# EAGLE design SB_TS_2.08_Final (EAGLE 8.5.0)
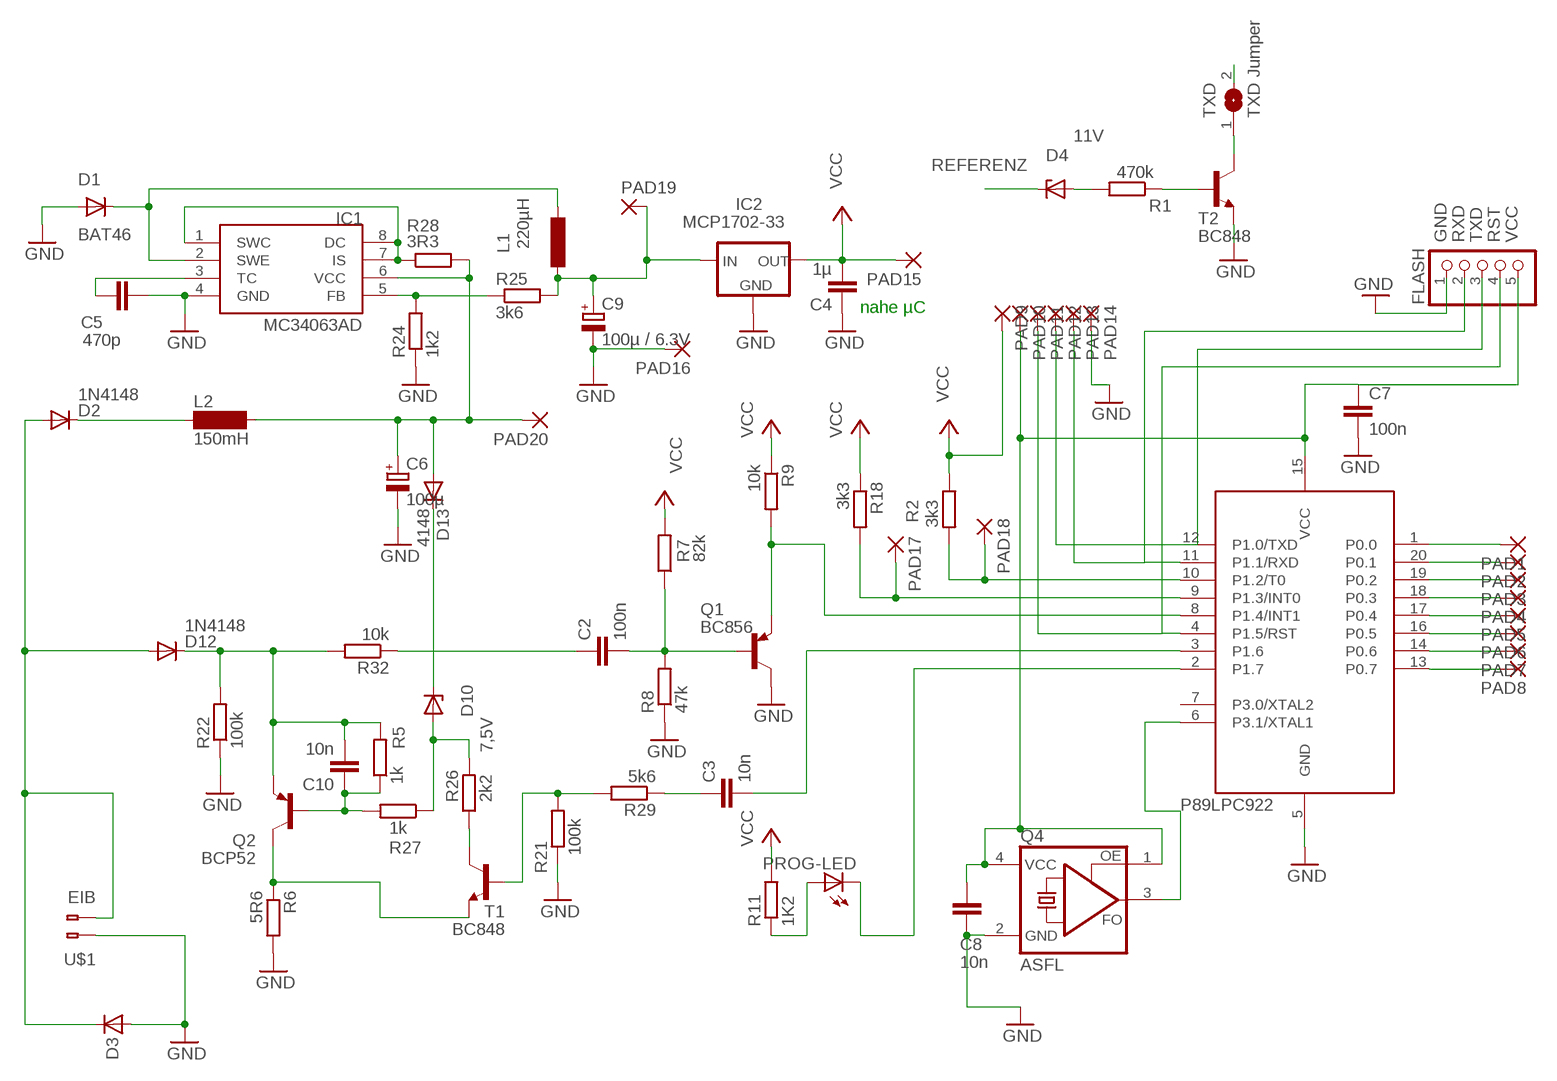
[diagram p0: schematic, sheet 1]

## Parts
C2  100n  C-EUC1206  [C1206]
C3  10n  C-EUC1206  [C1206]
C4  1µ  C-EUC1206  [C1206]
C5  470p  C-EUC1206  [C1206]
C6  100µ  CPOL-EUSANYO_SMD_C6  [SANYO-OSCON_SMD_C6]
C7  100n  C-EUC1206  [C1206]
C8  10n  C-EUC1206  [C1206]
C9  100µ / 6.3V  CPOL-EUE2.5-5  [E2,5-5]
C10  10n  C-EUC1206  [C1206]
D1  BAT46  DIODE-MINIMELF  [MINIMELF]
D2  1N4148  DIODE-MINIMELF  [MINIMELF]
D3  SMAJ40AC  D-SMB  [SMB]
D4  11V  ZENER-DIODESOD80C  [SOD80C]
D10  7,5V  ZENER-DIODESOD80C  [SOD80C]
D12  1N4148  DIODE-MINIMELF  [MINIMELF]
D13  4148  DIODE-MINIMELF  [MINIMELF]
FLASH  PINHD-1X5  [1X05]
IC1  MC34063AD  [SOIC8]
IC2  MCP1702-33  79LXX  [79LXX]
IC3  LPC922FDH  [TSSOP20]
L1  220µH  L-EU2200-11.43  [2200-11.43]
L2  150mH  SD12-1000  [SD12_1000]
PAD1  SMD2  [SMD1,27-2,54]
PAD2  SMD2  [SMD1,27-2,54]
PAD3  SMD2  [SMD1,27-2,54]
PAD4  SMD2  [SMD1,27-2,54]
PAD5  SMD2  [SMD1,27-2,54]
PAD6  SMD2  [SMD1,27-2,54]
PAD7  SMD2  [SMD1,27-2,54]
PAD8  SMD2  [SMD1,27-2,54]
PAD9  SMD2  [SMD1,27-2,54]
PAD10  SMD2  [SMD1,27-2,54]
PAD11  SMD2  [SMD1,27-2,54]
PAD12  SMD2  [SMD1,27-2,54]
PAD13  SMD2  [SMD1,27-2,54]
PAD14  SMD2  [SMD1,27-2,54]
PAD15  SMD2  [SMD1,27-2,54]
PAD16  SMD2  [SMD1,27-2,54]
PAD17  SMD2  [SMD1,27-2,54]
PAD18  SMD2  [SMD1,27-2,54]
PAD19  SMD2  [SMD1,27-2,54]
PAD20  SMD2  [SMD1,27-2,54]
PROG-LED  LEDCHIPLED_1206  [CHIPLED_1206]
Q1  BC856  BC856ALT1SMD  [SOT23-BEC]
Q2  BCP52  FZT753SMD  [SOT223]
Q4  ASFL  [ASF]
R1  470k  R-EU_R1206  [R1206]
R2  3k3  R-EU_M1206  [M1206]
R5  1k  R-EU_R1206  [R1206]
R6  5R6  R-EU_R1206  [R1206]
R7  82k  R-EU_R1206  [R1206]
R8  47k  R-EU_M1206  [M1206]
R9  10k  R-EU_R1206  [R1206]
R11  1K2  R-EU_R1206  [R1206]
R18  3k3  R-EU_R1206  [R1206]
R21  100k  R-EU_R1206  [R1206]
R22  100k  R-EU_M1206  [M1206]
R24  1k2  R-EU_R1206  [R1206]
R25  3k6  R-EU_M1206  [M1206]
R26  2k2  R-EU_M1206  [M1206]
R27  1k  R-EU_R1206  [R1206]
R28  3R3  R-EU_M1206  [M1206]
R29  5k6  R-EU_R1206  [R1206]
R32  10k  R-EU_R1206  [R1206]
T1  BC848  [SOT23]
T2  BC848  [SOT23]
TXD  TXD Jumper  SJ  [SJ]
U$1  EIB  [BUSKLEMME243-724]

## Nets
A_PUNKT_EIBIN: C2.2 Q1.B R7.1 R8.2
BASE_SEND: R21.2 R29.2 T1.1(B)
BASE_SEND_AMP: C10.1 Q2.1(B) R5.1 R27.2
C_T1: R26.1 T1.3(C)
CURR_SENSE: Q2.2(C) Q2.4(C) R6.1 T1.2(E)
EIB+: D2.A D3.1(C) D12.A U$1.2(B-2)
EIB_DC1: C6.+ D13.A IC1.6(VCC) L2.2 PAD20.1(P) R28.2
EIB_SEND: C3.2 IC3.3(P1.6)
EIBIN: IC3.8(P1.4/INT1) Q1.E R9.2
GND: C4.1 C5.2 C6.- C7.2 C8.2 C9.- D1.A D3.2(A) FLASH.1 IC1.4(GND) IC2.GND IC3.5(GND) PAD14.1(P) PAD16.1(P) Q1.C Q4.2(GND) R6.2 R8.1 R21.1 R22.1 R24.1 T2.2(E) U$1.1(B-1)
INT0: IC3.9(P1.3/INT0) PAD17.1(P) R18.2
N$1: D4.A R1.2
N$2: C3.1 R29.1
N$3: R1.1 T2.1(B)
N$5: C10.2 D12.C Q2.3(E) R5.2 R22.2 R32.2
N$6: C7.1 C8.1 FLASH.5 IC3.15(VCC) PAD10.1(P) Q4.1(OE) Q4.4(VCC)
N$8: D2.C L2.1
N$19: PROG-LED.A R11.1
N$51: D1.C IC1.2(SWE) L1.2
N$52: C5.1 IC1.3(TC)
N$58: D10.C D13.C
N$63: IC1.1(SWC) IC1.7(IS) IC1.8(DC) R28.1
N$77: C2.1 R32.1
OSCCLK: IC3.6(P3.1/XTAL1) Q4.3(FO)
P00: IC3.1(P0.0) PAD1.1(P)
P01: IC3.20(P0.1) PAD2.1(P)
P02: IC3.19(P0.2) PAD3.1(P)
P03: IC3.18(P0.3) PAD4.1(P)
P04: IC3.17(P0.4) PAD5.1(P)
P05: IC3.16(P0.5) PAD6.1(P)
P06: IC3.14(P0.6) PAD7.1(P)
P07: IC3.13(P0.7) PAD8.1(P)
PROG: IC3.2(P1.7) PROG-LED.C
PWM: IC3.10(P1.2/T0) PAD18.1(P) R2.2
REFERENZ: D4.C D10.A R26.2 R27.1
RESET: FLASH.4 IC3.4(P1.5/RST) PAD11.1(P)
RXD: FLASH.2 IC3.11(P1.1/RXD) PAD13.1(P)
TXD: FLASH.3 IC3.12(P1.0/TXD) PAD12.1(P) T2.3(C) TXD.1 TXD.2
VCC: C4.2 IC2.OUT PAD9.1(P) PAD15.1(P) R2.1 R7.2 R9.1 R11.2 R18.1
VCC5V: C9.+ IC2.IN L1.1 PAD19.1(P) R25.2
VCC_FEEDBACK: IC1.5(FB) R24.2 R25.1
Unconnected: IC3.7(P3.0/XTAL2)

## Notes on the sheet
- GND | RXD | TXD | RST | VCC
- nahe µC
- P89LPC922

## Library data of the parts
C2-C5 C7 C8 C10 = rcl:C-EU: CAPACITOR, European symbol
C6 C9 = rcl:CPOL-EU: POLARIZED CAPACITOR, European symbol
D1 D2 D12 D13 = diode:DIODE-: DIODE
D3 = semicon-smd-ipc:D-: DIODE unfilled
D4 D10 = diode:ZENER-DIODE: Z-Diode
FLASH = pinhead_2:PINHD-1X5: PIN HEADER
IC1 = mc34063:MC34063
IC2 = v-reg:79LXX: VOLTAGE REGULATOR
IC3 = LPCGira:LPC922FDH
L1 = rcl:L-EU: INDUCTOR, European symbol
L2 = inductor-neosid:SD12: INDUCTOR nominal inductance; OC_FARNELL: unknown; OC_NEWARK: unknown
PAD1-PAD20 = wirepad:SMD2: SMD PAD
PROG-LED = led:LED: LED OSRAM: - CHIPLED LG R971, LG N971, LY N971, LG Q971, LY Q971, LO R971, LY R971 LH N974, LH R974 LS Q976, LO Q976, LY Q976 LO Q996 - Hyper CHIPLED LW Q18S LB Q993, LB Q99A, LB R99A - SideLED LS A670, LO A670, LY A670, LG A670, LP A670 LB A673, LV A673, LT A673, LW A673 LH A674 LY A675 LS A676, LA A676, LO A676, LY A676, LW A676 LS A679, LY A679, LG A679 - Hyper Micro SIDELED® LS Y876, LA Y876, LO Y876, LY Y876 LT Y87S - SmartLED LW L88C, LW L88S LB L89C, LB L89S, LG L890 LS L89K, LO L89K, LY L89K LS L896, LA L896, LO L896, LY L896 - TOPLED LS T670, LO T670, LY T670, LG T670, LP T670 LSG T670, LSP T670, LSY T670, LOP T670, LYG T670 LG T671, LOG T671, LSG T671 LB T673, LV T673, LT T673, LW T673 LH T674 LS T676, LA T676, LO T676, LY T676, LB T676, LH T676, LSB T676, LW T676 LB T67C, LV T67C, LT T67C, LS T67K, LO T67K, LY T67K, LW E67C LS E67B, LA E67B, LO E67B, LY E67B, LB E67C, LV E67C, LT E67C LW T67C LS T679, LY T679, LG T679 LS T770, LO T770, LY T770, LG T770, LP T770 LB T773, LV T773, LT T773, LW T773 LH T774 LS E675, LA E675, LY E675, LS T675 LS T776, LA T776, LO T776, LY T776, LB T776 LHGB T686 LT T68C, LB T68C - Hyper Mini TOPLED® LB M676 - Mini TOPLED Santana® LG M470 LS M47K, LO M47K, LY M47K Source: http://www.osram.convergy.de LUXEON: - LUMILED® LXK2-PW12-R00, LXK2-PW12-S00, LXK2-PW14-U00, LXK2-PW14-V00 LXK2-PM12-R00, LXK2-PM12-S00, LXK2-PM14-U00 LXK2-PE12-Q00, LXK2-PE12-R00, LXK2-PE12-S00, LXK2-PE14-T00, LXK2-PE14-U00 LXK2-PB12-K00, LXK2-PB12-L00, LXK2-PB12-M00, LXK2-PB14-N00, LXK2-PB14-P00, LXK2-PB14-Q00 LXK2-PR12-L00, LXK2-PR12-M00, LXK2-PR14-Q00, LXK2-PR14-R00 LXK2-PD12-Q00, LXK2-PD12-R00, LXK2-PD12-S00 LXK2-PH12-R00, LXK2-PH12-S00 LXK2-PL12-P00, LXK2-PL12-Q00, LXK2-PL12-R00 Source: www.luxeon.com KINGBRIGHT: KA-3528ASYC Source: www.kingbright.com
Q1 = transistor-pnp:BC856*: PNP Transistror
Q2 = transistor-pnp:FZT753SMD: PNP Transistor
Q4 = crystal:ASF*: CRYSTAL CLOCK OSCILLATORS 5.0 Vdc or 3.3 Vdc - LOW PROFILE ULTRA MINIATURE CERAMIC SURFACE MOUNT Source: http://www.abracon.com/Oscillators/asf1-L-L1.pdf; MPN: ASFLM1-50.000MHZ-C-T; OC_FARNELL: 1838931; OC_NEWARK: 99M0411
R1 R2 R5-R9 R11 R18 R21 R22 R24-R29 R32 = rcl:R-EU_: RESISTOR, European symbol
T1 T2 = transistor:BC848: NPN TRANSISTOR
TXD = jumper:SJ: SMD solder JUMPER
U$1 = con-wago:EIB

## Board
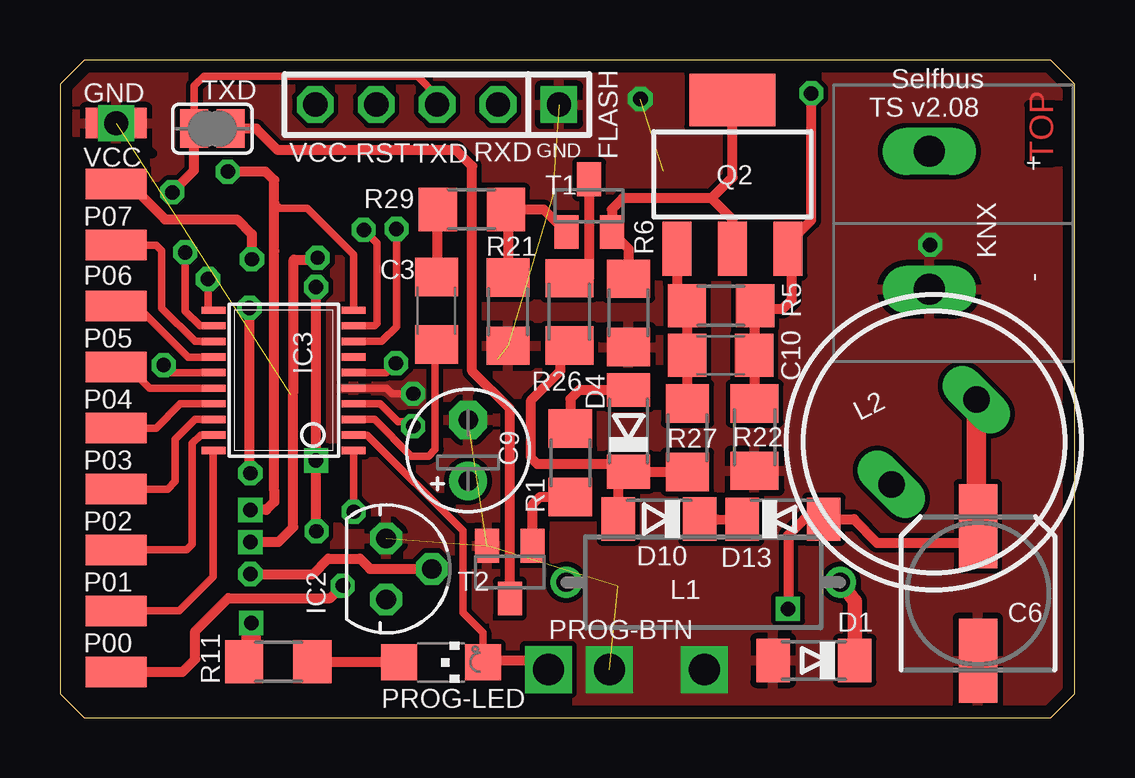
[diagram p1: board, top side]
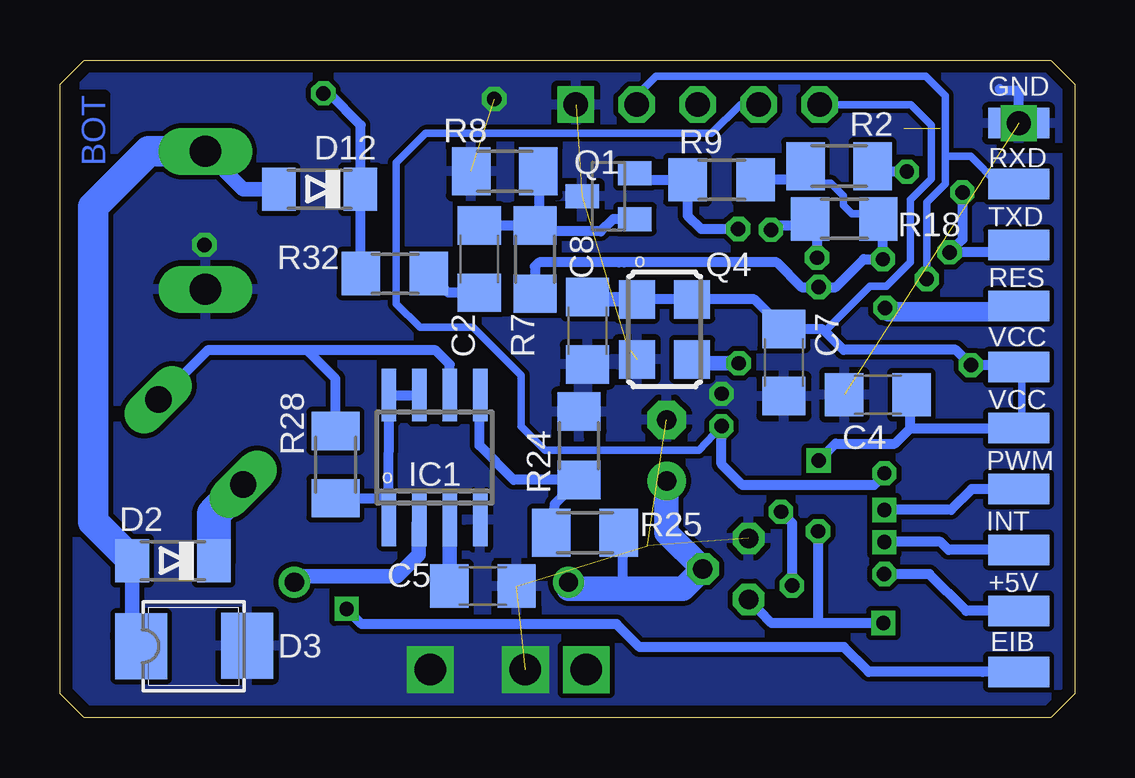
[diagram p2: board, bottom side, seen from below]

Size 42.3 x 27.4 mm. Coordinates in mm from the lower left corner, seen from the top.
Outline: 1,0 41.3,0 42.3,1 42.3,26.4 41.3,27.4 1,27.4 0,26.4 0,1 1,0
Copper layers (1*16): Top 0.035mm / dielectric 1.5mm / Bottom 0.035mm
Design rules "SB_TS_2.03": minimum track width 10mil, minimum drill 0.6mm, track to track 0.205mm, track to pad 0.205mm, pad to pad 0.205mm, via to via 0.205mm, smd to smd 8mil, copper to edge 20mil, drill to drill 8mil, minimum pad ring 10mil, minimum via ring 8mil, stop-mask expansion 4mil, vias tented up to drill 0mil, thermal gap 10mil
tRestrict: 2 lines
bRestrict: 1 lines

### Footprints (pad centres in the part's own frame; a part is rotated, then mirrored left to right if it is on the bottom)
C1206 = smd 1.6 x 1.8: 1 -1.4,0; 2 1.4,0
SANYO-OSCON_SMD_C6 = smd 3.5 x 1.6: + 2.8,0; - -2.8,0
E2,5-5 = drill 0.813 pad 1.6: + -1.27,0 | drill 0.813 pad 1.6 octagon: - 1.27,0
MINIMELF = smd 1.4 x 1.8: A 1.7,0; C -1.7,0
SMB = smd 2.159 x 2.743: 1 -2.311,-0.127; 2 2.108,-0.102
SOD80C = smd 1.4 x 1.8: A 1.7,0; C -1.7,0
1X05 = drill 1.016 square: 1 -5.08,0 | drill 1.016 octagon: 2 -2.54,0; 3 0,0; 4 2.54,0; 5 5.08,0
SOIC8 = smd 0.6 x 2.2: 1 -1.905,-2.6; 2 -0.635,-2.6; 3 0.635,-2.6; 4 1.905,-2.6; 5 1.905,2.6; 6 0.635,2.6; 7 -0.635,2.6; 8 -1.905,2.6
79LXX = drill 0.813 octagon: GND -1.27,0; IN 0,1.905; OUT 1.27,0
TSSOP20 = smd 0.305 x 0.991: 1 -2.925,-2.918; 2 -2.275,-2.918; 3 -1.625,-2.918; 4 -0.975,-2.918; 5 -0.325,-2.918; 6 0.325,-2.918; 7 0.975,-2.918; 8 1.625,-2.918; 9 2.275,-2.918; 10 2.925,-2.918; 11 2.925,2.918; 12 2.275,2.918; 13 1.625,2.918; 14 0.975,2.918; 15 0.325,2.918; 16 -0.325,2.918; 17 -0.975,2.918; 18 -1.625,2.918; 19 -2.275,2.918; 20 -2.925,2.918
2200-11.43 = drill 0.8 pad 1.27: 1 -5.715,0; 2 5.715,0
SD12_1000 = drill 1.1 long: 1 -2.5,0; 2 2.5,0
SMD1,27-2,54 = smd 1.27 x 2.54: 1 0,0
CHIPLED_1206 = smd 1.5 x 1.5: A 0,-1.75; C 0,1.75
SOT23-BEC = smd 1 x 1.4: B -0.95,-1.1; C 0,1.1; E 0.95,-1.1
SOT223 = smd 1.219 x 2.235: 1 -2.311,-3.099; 2 0,-3.099; 3 2.311,-3.099 | smd 3.6 x 2.2: 4 0,3.099
ASF = smd 1.6 x 1.5: 1 -1.25,-1.15; 2 1.25,-1.15; 3 1.25,1.15; 4 -1.25,1.15
R1206 = smd 1.6 x 1.803: 1 -1.422,0; 2 1.422,0
M1206 = smd 1.6 x 2: 1 -1.4,0; 2 1.4,0
SOT23 = smd 1 x 1.4: 1 -0.95,-1.1; 2 0.95,-1.1; 3 0,1.1
SJ = smd 1.168 x 1.6: 1 -0.762,0; 2 0.762,0
BUSKLEMME243-724 = drill 1.3 long: 1 -2.875,0; 2 2.875,0

### Placement (x,y rotation side)
C2  24.82,19.1 90 bottom
C3  15.69,16.95 270 top
C4  8.21,13.45 0 bottom
C5  24.67,5.48 0 bottom
C6  38.26,5.17 90 top
C7  12.12,14.79 270 bottom
C8  20.31,16.12 270 bottom
C9  17.01,11.13 90 top
C10  27.54,15.1 0 top
D1  31.43,2.38 180 top
D2  37.59,6.54 180 bottom
D3  36.61,3.1 0 bottom
D4  23.7,11.94 90 top
D10  24.97,8.28 180 top
D12  31.48,22.02 180 bottom
D13  30.14,8.26 0 top
FLASH  15.72,25.54 180 top
IC1  26.69,10.84 0 bottom
IC2  13.59,6.2 270 top
IC3  9.33,14.05 90 top
L1  26.82,5.64 0 top
L2  36.43,11.48 45 top
PAD1  2.34,1.91 90 top
PAD2  2.34,4.45 90 top
PAD3  2.34,6.99 90 top
PAD4  2.34,9.53 90 top
PAD5  2.34,12.06 90 top
PAD6  2.34,14.61 90 top
PAD7  2.34,17.14 90 top
PAD8  2.34,19.68 90 top
PAD9  2.34,12.06 90 bottom
PAD10  2.34,14.61 270 bottom
PAD11  2.34,17.14 270 bottom
PAD12  2.34,19.68 270 bottom
PAD13  2.34,22.23 90 bottom
PAD14  2.34,24.77 270 bottom
PAD15  2.34,22.23 90 top
PAD16  2.34,24.77 90 top
PAD17  2.34,6.99 90 bottom
PAD18  2.34,9.53 270 bottom
PAD19  2.34,4.45 270 bottom
PAD20  2.34,1.91 90 bottom
PROG-LED  15.88,2.3 270 top
Q1  19.44,21.72 90 bottom
Q2  28.03,22.63 0 top
Q4  17.1,16.18 270 bottom
R1  21.28,10.62 90 top
R2  9.82,22.98 0 bottom
R5  27.56,17.16 0 top
R6  23.7,16.86 270 top
R7  22.5,19.08 270 bottom
R8  23.76,22.76 0 bottom
R9  14.72,22.41 180 bottom
R11  9.1,2.33 180 top
R18  9.61,20.78 180 bottom
R21  18.67,16.91 90 top
R22  28.96,11.69 90 top
R24  20.66,11.33 270 bottom
R25  20.42,7.7 0 bottom
R26  21.23,16.91 270 top
R27  26.15,11.66 90 top
R28  30.82,10.54 90 bottom
R29  17.17,21.17 0 top
R32  28.34,18.5 180 bottom
T1  22.05,21.33 0 top
T2  18.75,6.06 180 top
TXD  6.35,24.54 0 top
U$1  36.24,20.72 90 top

### Tracks (layer width: path | path; a pad name or v marks a point on that pad's centre or on a via)
A_PUNKT_EIBIN
  Bottom 0.406: R8.2 22.34,20.85 R7.1 | R7.1 23.11,20.68 23.3,20.5 C2.2 | Q1.B 19.25,20.77 19.76,20.26 22.25,20.26 R7.1
BASE_SEND
  Top 0.305: R21.2 18.59,18.66
  Top 0.406: T1.1 20.16,21.17 R29.2 18.67,21.09 R21.2
BASE_SEND_AMP
  Top 0.305: 26.14,14.96 C10.1
  Top 0.406: 26.18,14.96 26.14,14.96 26.14,13.08 R27.2 26.42,12.88 26.16,12.96 | Q2.1 25.72,17.16 R5.1 C10.1
C_T1
  Top 0.406: T1.3 22.05,18.31 R26.1
CURR_SENSE
  Top 0.406: Q2.2 28.03,20.77 27.16,21.64 | 27.16,21.64 23.46,21.64 23,21.18 T1.2 23.7,19.53 R6.1 | 27.16,21.64 28.03,22.51 Q2.4
EIB+
  Bottom 0.61: 39.29,3.41 D2.A | D12.A 34.66,22.02 U$1.2
  Bottom 1.27: U$1.2 38.61,23.59 40.92,21.28 40.92,8.16 D2.A | 39.25,3.21 D3.1
  Bottom 1.422: 39.25,3.21 39.29,3.41
EIB_DC1  (via drill 0.6)
  Top 0.406: v30.35,4.53 v30.36,4.54 30.36,7.6 31.03,8.27 D13.A 33.09,8.27 34.06,7.28 38.2,7.28
  Top 0.813: L2.2 38.2,7.28 38.26,7.28 C6.+
  Top 1.016: L2.2
  Bottom 0.406: PAD20.1 2.97,1.91 3.85,1.91 8.59,1.91 9.62,2.94 18.14,2.94 19.1,3.9 29.72,3.9 v30.35,4.53 | L2.2 36.15,15.3 32,15.3 | R28.2 30.82,14.12 32,15.3 | IC1.6 26.05,14.71 26.64,15.3 32,15.3
EIB_SEND
  Top 0.305: C3.2 16,15.72 15.62,15.27 | 15.83,15.89 C3.2 | IC3.3 13.12,12.42 14.64,10.9 15.36,10.9 15.64,11.18 15.64,15.5 C3.2
  Top 0.406: 15.72,16 C3.2
EIBIN  (via drill 0.6)
  Top 0.305: IC3.8 13.41,15.67 14.03,16.29 v14.03,20.36
  Bottom 0.406: Q1.E 18.08,22.41 R9.2 16.14,20.92 15.58,20.36 v14.03,20.36
GND  (via drill 0.6, 1, 1.3)  (9 unrouted)
  Top 0.305: v14.72,13.49 13.85,13.49 13.61,13.73 12.41,13.73 IC3.5
  Bottom 0.406: PAD16.1 2.34,26.11 3.05,26.11 3.13,26.19
  other vias: 2.34,24.77 26.86,2 22.9,2 24.21,25.77 24.19,25.77 24.2,25.78 24.19,25.78 24.19,25.77 36.28,19.7
  pour Bottom: -1.15,28.1 42.58,28.1 42.82,27.94 42.82,-0.16 42.42,-0.48 -0.44,-0.48 -0.52,-0.4 -0.52,10.56 -0.83,10.87
  pour Top: -0.52,-0.79 -0.52,28.34 42.66,28.34 42.66,-0.71 3.21,-0.71
INT0  (via drill 0.6)
  Top 0.305: IC3.9 13.11,16.32 13.21,16.43 13.21,19.76 v12.66,20.32
  Top 0.406: v10.74,19.16 10.62,19.08 9.74,19.08 9.72,7.94 9.09,7.31 v7.93,7.31
  Bottom 0.305: 10.74,20.49 R18.2 | 10.78,19.2 v10.74,19.16
  Bottom 0.406: R18.2 10.86,20.82 | v12.66,20.32 12.49,20.49 10.74,20.49 v10.74,19.16 | PAD17.1 5.26,6.99 5.6,7.32 v7.92,7.32
  Bottom 0.61: v7.92,7.32 v7.93,7.31
N$1
  Top 0.406: D4.A 21.64,13.64 21.28,13.28 R1.2
N$2
  Top 0.305: 15.69,21.18 R29.1
  Top 0.406: C3.1 15.75,18.41 R29.1
N$3
  Top 0.305: 21.04,9.36 21.18,9.2 R1.1
  Top 0.406: T2.1 19.7,8.88 20.02,9.2 R1.1
N$4
  Bottom 0.305: 2.2,12.4 2.2,14.1
N$5  (via drill 0.6)
  Top 0.305: R5.2 28.96,17.04 | 28.96,12.95 R22.2
  Top 0.406: v31.32,26.01 31.32,20.72 30.28,19.68 30.2,19.68 30.25,20.06 Q2.3 30.5,19.38 30.5,17.4 30.14,17.04 28.96,17.04 28.94,17.02 C10.2 | 28.95,15.03 28.96,15.03 R22.2
  Top 1.27: C10.2 arc90 28.95,15.03
  Bottom 0.406: D12.C 29.76,22 R32.2 29.76,24.69 31.08,26.01 v31.32,26.01
  Bottom 0.61: 29.68,21.92 D12.C
N$6  (via drill 0.6)
  Top 0.305: IC3.15 4.63,14.37 v4.32,14.68
  Bottom 0.305: 3.37,14.68 2.9,14.61 | 10.5,16.18 10.34,16.18 8.54,17.98 7.86,17.98 6.86,18.98 6.86,21.58 5.98,22.46 5.98,24.68 6.84,25.54 FLASH.5 | 15.6,17.66 Q4.4
  Bottom 0.406: Q4.1 Q4.4 13.35,17.43 C7.1 12.11,16.18 10.5,16.18 9.64,15.32 4.96,15.32 v4.32,14.68 3.37,14.68 | 19.92,17.67 C8.1 | PAD10.1 2.9,14.61
  Bottom 0.61: Q4.1 20.22,17.43 C8.1
N$8
  Bottom 1.422: L2.1 35.89,8.49 D2.C
N$19
  Top 0.406: R11.1 14.11,2.33 PROG-LED.A
N$51
  Top 0.61: L1.2 33.13,4.85 D1.C
  Bottom 0.61: L1.2 32.53,5.47 32.1,5.9 28.24,5.9 27.36,6.78 27.36,8.02 IC1.2
N$52
  Bottom 0.61: C5.1 26.07,8 IC1.3
N$58
  Top 0.406: D10.C 27.4,8.24 D13.C
N$63
  Bottom 0.406: IC1.7 IC1.8 28.63,8.65 28.62,8.64 | R28.1 28.78,9.14 28.62,8.98 28.62,8.64 | 28.62,8.64 28.62,8.03 IC1.1
N$77
  Bottom 0.305: 26.38,19.26 R32.1
  Bottom 0.406: C2.1 26.12,17.7 R32.1
OSCCLK  (via drill 0.6)
  Top 0.305: IC3.6 13.6,14.37 v14.01,14.76
  Bottom 0.406: 15.67,15.16 Q4.3
  Bottom 0.61: v14.01,14.76 15.79,14.76 Q4.3
P00  (via drill 0.6)
  Top 0.305: v12.25,8.58 v12.24,8.58 IC3.1
  Top 0.406: PAD1.1 3.13,1.91 3.14,1.9 5.1,1.9 5.64,2.44 5.64,3.6 7.02,4.98 11.27,4.98 v11.79,5.5
  Bottom 0.406: v12.25,8.58 11.79,8.12 v11.79,5.5
P01
  Top 0.305: IC3.20 6.39,11.12 6.39,5.87 4.96,4.45 3.42,4.45
  Top 0.406: PAD2.1 3.42,4.45
P02
  Top 0.305: IC3.19 5.86,11.77 5.51,11.43 5.51,7.22 5.28,6.99 3.42,6.99
  Top 0.406: PAD3.1 3.42,6.99
P03
  Top 0.305: IC3.18 5.64,12.42 4.8,11.59 4.8,9.84 4.48,9.53 3.42,9.53
  Top 0.406: PAD4.1 3.42,9.53
P04
  Top 0.305: IC3.17 5.02,13.07 4.01,12.06 3.42,12.06
  Top 0.406: PAD5.1 3.42,12.06
P05
  Top 0.305: IC3.16 3.75,13.72 2.87,14.61
  Top 0.406: PAD6.1 2.87,14.61
P06
  Top 0.305: IC3.14 5.33,15.02 3.21,17.14 3.05,17.14 2.7,17.5
  Top 0.406: PAD7.1 2.7,17.5
P07
  Top 0.305: IC3.13 5.64,15.67 4.25,17.07 4.25,19.45 4.01,19.68 PAD8.1
PROG  (via drill 1.3)
  Top 0.305: IC3.2 12.81,11.77 16.8,7.78 16.8,4.36 17.63,3.53 PROG-LED.C 17.56,2.38 17.26,2.38
  Top 0.406: 17.56,2.38 20.21,2.38 20.37,2.38 20.36,2.38 v20.36,2
  Top 0.813: 20.37,2.38 arc90 20.36,2.38
PWM  (via drill 0.6)
  Top 0.305: IC3.10 12.24,19.28 10.3,21.22 9.15,21.22 8.93,21.44
  Top 0.406: v7.93,8.65 7.94,8.66 8.6,8.66 8.93,8.99 8.93,9.45 8.93,19.45 8.93,21.44 8.93,22.39 8.57,22.75 v7,22.75
  Bottom 0.406: PAD18.1 4.29,9.53 5.16,8.66 v7.93,8.66 v7.93,8.65 | v7,22.75 8.16,22.75 R2.2
  Bottom 0.61: v7.92,8.64 v7.93,8.65
REFERENZ
  Top 0.305: R26.2 20.95,16.1 | R26.2 21.09,15.51 | 20.68,15.16 20.86,15.16 R26.2 | 22.72,10.56 23.44,10.54 23.36,10.37 D4.C
  Top 0.406: D10.A 23.28,9.79 D4.C R27.1 | 22.72,10.56 19.9,10.56 19.64,10.82 19.64,13.22 20.86,14.44 20.86,15.16
RESET  (via drill 0.6)
  Top 0.305: IC3.4 13.35,13.07 14.1,12.32 14.55,12.32 v14.72,12.14
  Top 0.406: v7.94,10.18 7.9,10.22 v7.9,17.07
  Bottom 0.305: 14.78,11.7 14.72,11.64 | FLASH.4 13.94,25.54 15.14,24.34 27.06,24.34 28.28,23.12 28.28,17.24 27.3,16.26 25.08,16.26 23.08,14.26 23.08,12.14 22.08,11.14 15.67,11.14 v14.72,12.14
  Bottom 0.406: v7.94,10.18 7.98,10.08 8.37,9.68 13.85,9.68 14.72,10.56 14.72,11.64 v14.72,12.14
  Bottom 0.813: PAD11.1 2.56,16.92 7.75,16.92 arc90 v7.9,17.07
RXD  (via drill 0.6)
  Top 0.305: v6.17,18.27 6.17,16.97 IC3.11
  Bottom 0.305: FLASH.2 18.26,25.92 17.46,26.72 6.2,26.72 5.4,25.92 5.4,23.38 | v6.17,18.27 6.17,21.47 5.4,22.24 5.4,23.38 | 5.4,23.38 4.34,23.38 3.22,22.26 2.38,22.26 PAD13.1
  Bottom 0.406: PAD13.1 2.42,22.23
TXD  (via drill 0.6)  (1 unrouted)
  Top 0.305: IC3.12 5.84,16.32 5.22,16.94 v5.22,19.39 | 5.6,24.52 TXD.1 5.6,24.93 5.6,26.32 6,26.72 14.9,26.72 15.72,25.9 FLASH.3 | 7.15,24.9 TXD.2
  Top 0.406: T2.3 18.75,12.87 17.18,14.44 17.18,22.98 16.52,23.64 9.08,23.64 8.18,24.54 TXD.2 | v4.68,21.89 5.59,22.8 TXD.1
  Bottom 0.305: PAD12.1 2.36,19.66
  Bottom 0.406: PAD12.1 2.64,19.39 v5.22,19.39 4.68,19.93 v4.68,21.89
VCC  (via drill 0.6)
  Top 0.406: PAD15.1 3.29,22.23 3.29,21.85 4.38,20.76 7.38,20.76 8,20.14 v8,19.1 | 10.67,7.79 v10.67,10.72 v10.67,17.94
  Top 0.61: v10.67,10.72 10.67,10.79
  Top 0.813: v10.69,7.77 10.67,7.79 | v7.98,3.94 7.98,2.33 R11.2
  Bottom 0.305: 8.1,20.75 R18.1 8.35,21 9.3,21 9.64,21.34 9.64,21.74 10.16,22.26 10.5,22.26 R2.1
  Bottom 0.406: 7.99,21.15 R18.1 | 7.9,20.73 R18.1 | 8.04,20.63 R18.1 | IC2.OUT 12.64,3.94 v7.98,3.94 10.69,3.94 v10.69,7.77 | v10.67,10.72 9.97,11.42 7.5,11.42 6.86,12.06 | 8,20.59 v8,19.1 8.8,19.1 9.96,17.94 v10.67,17.94 11.39,17.94 12.42,18.97 18.77,18.97 19.01,18.97 22.33,18.97 22.5,18.8 22.5,17.84 R7.2 | R18.1 | R2.1 10.98,23.08 11.66,22.41 R9.1 | 6.86,12.06 6.86,13.4 C4.2 | 6.86,12.06 PAD9.1
  Bottom 0.61: 10.66,10.7 v10.67,10.72 | 8,20.59 R18.1 | v10.67,17.94
VCC5V  (via drill 0.6)
  Top 0.406: v7.94,5.98 10.54,5.98 11.18,6.62 12.5,6.62 12.92,6.2 IC2.IN 15.5,6.18
  Bottom 0.406: 7.92,5.96 v7.94,5.98 | PAD19.1 4.52,4.45 6.06,5.98 v7.93,5.98 | R25.2 arc-90 18.9,7.57 18.86,7.53 18.86,5.36
  Bottom 0.813: v7.93,5.98 v7.94,5.98
  Bottom 1.016: L1.1 21.1,5.36 18.86,5.36 16.34,5.36 IC2.IN 17.01,7.71 C9.+
VCC_FEEDBACK
  Bottom 0.406: R25.1 21.68,8.89 R24.2 23.39,9.91 24.82,11.34 24.82,13.22 IC1.5

### Text on the board
Top: TOP
Bottom: BOT
tPlace: Selfbus | GND | TS v2.08 | + | VCC | VCC | RST | TXD | RXD | GND | P07 | KNX | P06 | - | P05 | P04 | P03 | P02 | P01 | P00 | PROG-BTN
bPlace: GND | RXD | TXD | o | RES | VCC | VCC | PWM | o | INT | +5V | EIB
tDocu: GND | VCC | P07 | P06 | P05 | P04 | P03 | P02 | P01 | P00
bDocu: GND | RXD | TXD | RES | Vin | VCC | PWM | INT0 | +5V | EIB_DC